# Altium schematic sheet W5500_1.SchDoc
size A4
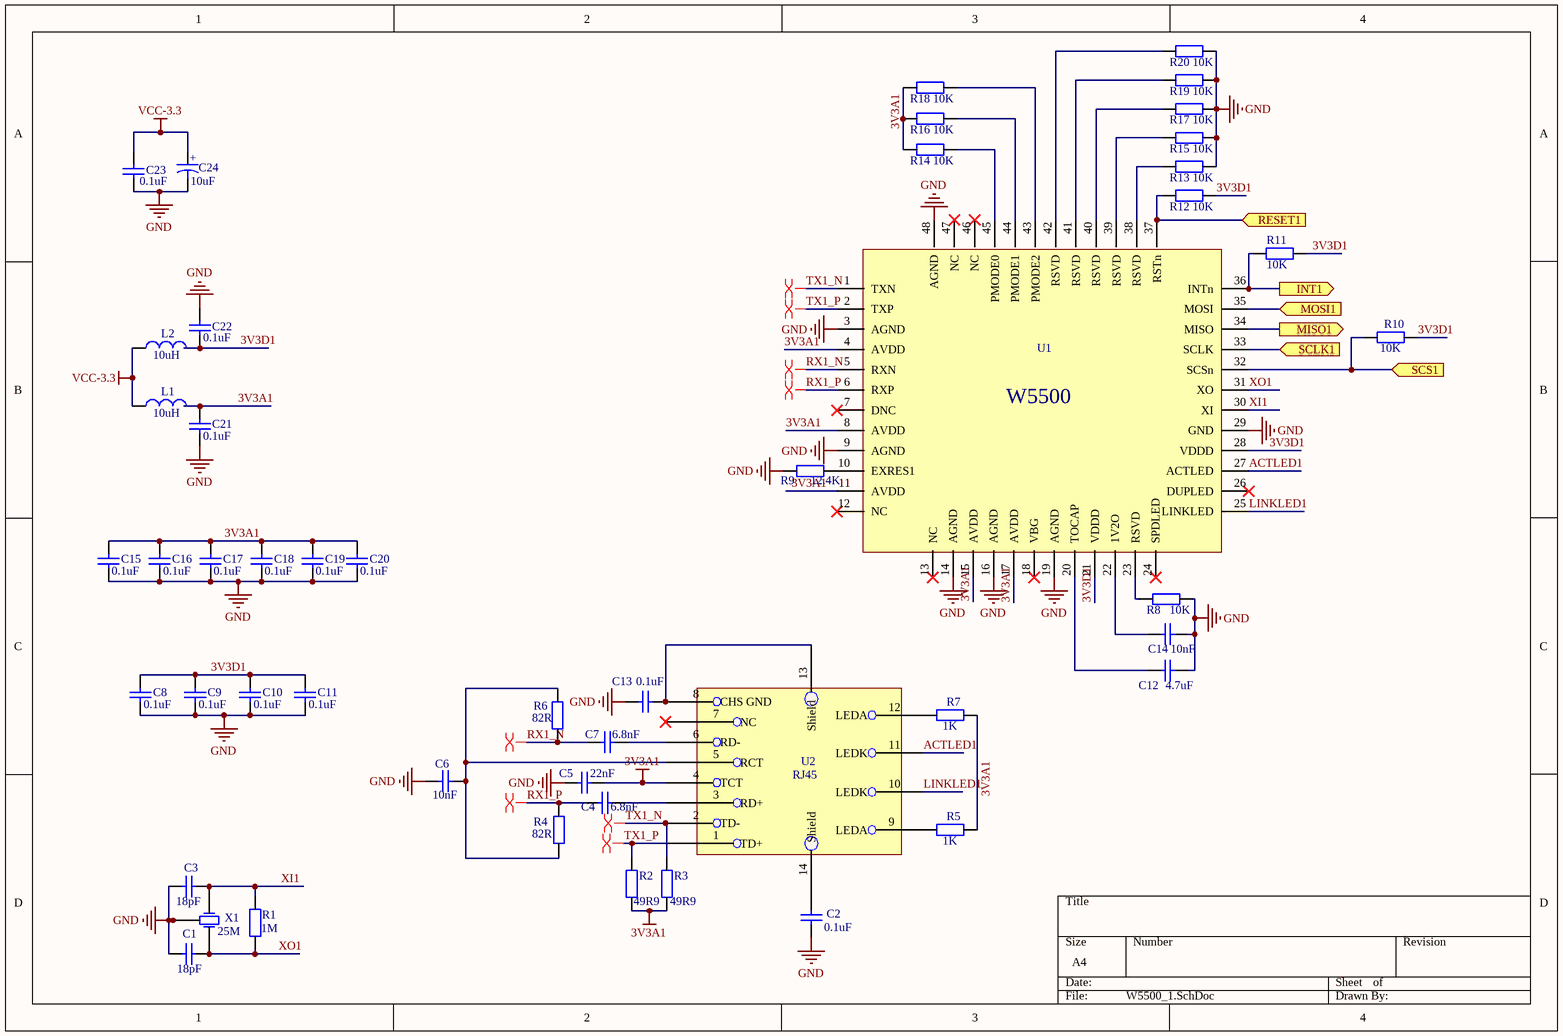
[diagram p0: W5500_1.SchDoc]

## Parts
C1  value 18pF  [0603]  (hidden comment: Capacitor-0603)
C2  value 0.1uF  [0603]  (hidden comment: Capacitor-0603)
C3  value 18pF  [0603]  (hidden comment: Capacitor-0603)
C4  value 6.8nF  [0603]  (hidden comment: Capacitor-0603)
C5  value 22nF  [0603]  (hidden comment: Capacitor-0603)
C6  value 10nF  [0603]  (hidden comment: Capacitor-0603)
C7  value 6.8nF  [0603]  (hidden comment: Capacitor-0603)
C8  value 0.1uF  [0603]  (hidden comment: Capacitor-0603)
C9  value 0.1uF  [0603]  (hidden comment: Capacitor-0603)
C10  value 0.1uF  [0603]  (hidden comment: Capacitor-0603)
C11  value 0.1uF  [0603]  (hidden comment: Capacitor-0603)
C12  value 4.7uF  [0603]  (hidden comment: Capacitor-0805)
C13  value 0.1uF  [0603]  (hidden comment: Capacitor-0603)
C14  value 10nF  [0603]  (hidden comment: Capacitor-0603)
C15  value 0.1uF  [0603]  (hidden comment: Capacitor-0603)
C16  value 0.1uF  [0603]  (hidden comment: Capacitor-0603)
C17  value 0.1uF  [0603]  (hidden comment: Capacitor-0603)
C18  value 0.1uF  [0603]  (hidden comment: Capacitor-0603)
C19  value 0.1uF  [0603]  (hidden comment: Capacitor-0603)
C20  value 0.1uF  [0603]  (hidden comment: Capacitor-0603)
C21  value 0.1uF  [0603]  (hidden comment: Capacitor-0603)
C22  value 0.1uF  [0603]  (hidden comment: Capacitor-0603)
C23  value 0.1uF  [0603]  (hidden comment: Capacitor-0603)
C24  value 10uF  [钽电容1206（A3216）]  (hidden comment: 电解电容)
L1  value 10uH  [0805]  (hidden comment: Inductor)
L2  value 10uH  [0805]  (hidden comment: Inductor)
R1  value 1M  [0603]  (hidden comment: Resistor-0603)
R2  value 49R9  [0603]  (hidden comment: Resistor-0603)
R3  value 49R9  [0603]  (hidden comment: Resistor-0603)
R4  value 82R  [0603]  (hidden comment: Resistor-0603)
R5  value 1K  [0603]  (hidden comment: Resistor-0603)
R6  value 82R  [0603]  (hidden comment: Resistor-0603)
R7  value 1K  [0603]  (hidden comment: Resistor-0603)
R8  value 10K  [0603]  (hidden comment: Resistor-0603)
R9  value 12.4K  [0603]  (hidden comment: Resistor-0603)
R10  value 10K  [0603]  (hidden comment: Resistor-0603)
R11  value 10K  [0603]  (hidden comment: Resistor-0603)
R12  value 10K  [0603]  (hidden comment: Resistor-0603)
R13  value 10K  [0603]  (hidden comment: Resistor-0603)
R14  value 10K  [0603]  (hidden comment: Resistor-0603)
R15  value 10K  [0603]  (hidden comment: Resistor-0603)
R16  value 10K  [0603]  (hidden comment: Resistor-0603)
R17  value 10K  [0603]  (hidden comment: Resistor-0603)
R18  value 10K  [0603]  (hidden comment: Resistor-0603)
R19  value 10K  [0603]  (hidden comment: Resistor-0603)
R20  value 10K  [0603]  (hidden comment: Resistor-0603)
U1  W5500  [W5500]  (value not drawn)
U2  RJ45  [RJ45]
X1  value 25M  [3225无源晶振]  (hidden comment: 3225无源晶振)

## Ports
INT1 (out), MISO1 (out), MOSI1 (in), RESET1 (in), SCLK1 (in), SCS1 (in)

## Nets
3V3A1: C5.2 C15.1 C16.1 C17.1 C18.1 C19.1 C20.1 C21.1 L1.2 R2.2 R3.2 R5.2 R7.2 R14.2 R16.2 R18.2 U1.4(AVDD) U1.8(AVDD) U1.11(AVDD) U1.15(AVDD) U1.17(AVDD) U2.4(TCT)
GND: C1.1 C2.2 C3.1 C5.1 C6.1 C8.2 C9.2 C10.2 C11.2 C12.2 C13.2 C14.1 C15.2 C16.2 C17.2 C18.2 C19.2 C20.2 C21.2 C22.2 C23.1 C24.1 R8.1 R9.2 R13.1 R15.1 R17.1 R19.1 R20.1 U1.3(AGND) U1.9(AGND) U1.14(AGND) U1.16(AGND) U1.19(AGND) U1.29(GND) U1.48(AGND) X1.2(GND) X1.4(GND)
VCC-3.3: C23.2 C24.2 L1.1 L2.1
3V3D1: C8.1 C9.1 C10.1 C11.1 C22.1 L2.2 R10.2 R11.2 R12.1 U1.21(VDDD) U1.28(VDDD)
ACTLED1: U1.27(ACTLED) U2.11(LEDK)
INT1: R11.1 U1.36(INTn) ; port INT1
LINKLED1: U1.25(LINKLED) U2.10(LEDK)
MISO1: U1.34(MISO) ; port MISO1
MOSI1: U1.35(MOSI) ; port MOSI1
RESET1: R12.2 U1.37(RSTn) ; port RESET1
RX1_N: C7.1 R6.2 U1.5(RXN)
RX1_P: C4.1 R4.1 U1.6(RXP)
SCLK1: U1.33(SCLK) ; port SCLK1
SCS1: R10.1 U1.32(SCSn) ; port SCS1
TX1_N: R3.1 U1.1(TXN) U2.2(TD-)
TX1_P: R2.1 U1.2(TXP) U2.1(TD+)
XI1: C3.2 R1.1 U1.30(XI) X1.1(OSC1)
XO1: C1.2 R1.2 U1.31(XO) X1.3(OSC2)
NetC2_1: C2.1 U2.14(Shield)
NetC4_2: C4.2 U2.3(RD+)
NetC6_2: C6.2 R4.2 R6.1 U2.5(RCT)
NetC7_2: C7.2 U2.6(RD-)
NetC12_1: C12.1 U1.20(TOCAP)
NetC13_1: C13.1 U2.8(CHS_GND) U2.13(Shield)
NetC14_2: C14.2 U1.22(1V2O)
NetR5_1: R5.1 U2.9(LEDA)
NetR7_1: R7.1 U2.12(LEDA)
NetR8_2: R8.2 U1.23(RSVD)
NetR9_1: R9.1 U1.10(EXRES1)
NetR13_2: R13.2 U1.38(RSVD)
NetR14_1: R14.1 U1.45(PMODE0)
NetR15_2: R15.2 U1.39(RSVD)
NetR16_1: R16.1 U1.44(PMODE1)
NetR17_2: R17.2 U1.40(RSVD)
NetR18_1: R18.1 U1.43(PMODE2)
NetR19_2: R19.2 U1.41(RSVD)
NetR20_2: R20.2 U1.42(RSVD)

Not connected (* = marked no-connect by the designer): U1 7(DNC)* 12(NC)* 13(NC)* 18(VBG)* 24(SPDLED)* 26(DUPLED)* 46(NC)* 47(NC)*; U2 7(NC)*

## Layout directives
differential pair: RX1_N, RX1_P, TX1_N, TX1_P

## Notes on the sheet
- (in symbol 电解电容) +

## Library data of the parts
U1 = W5500: Name: W5500
U2 = RJ45: Name: RJ45